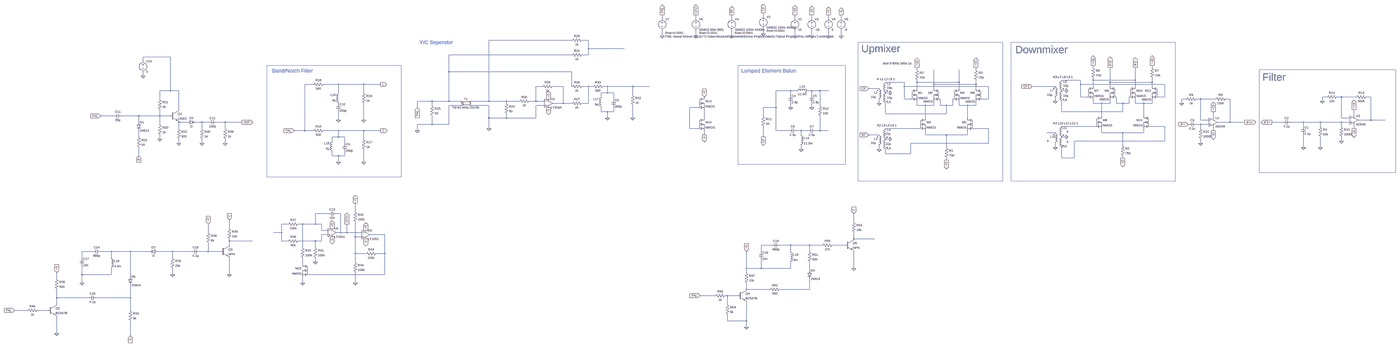
[diagram p0: schematic Gilbert_Cell_Mixer_Alt.asc, whole sheet]
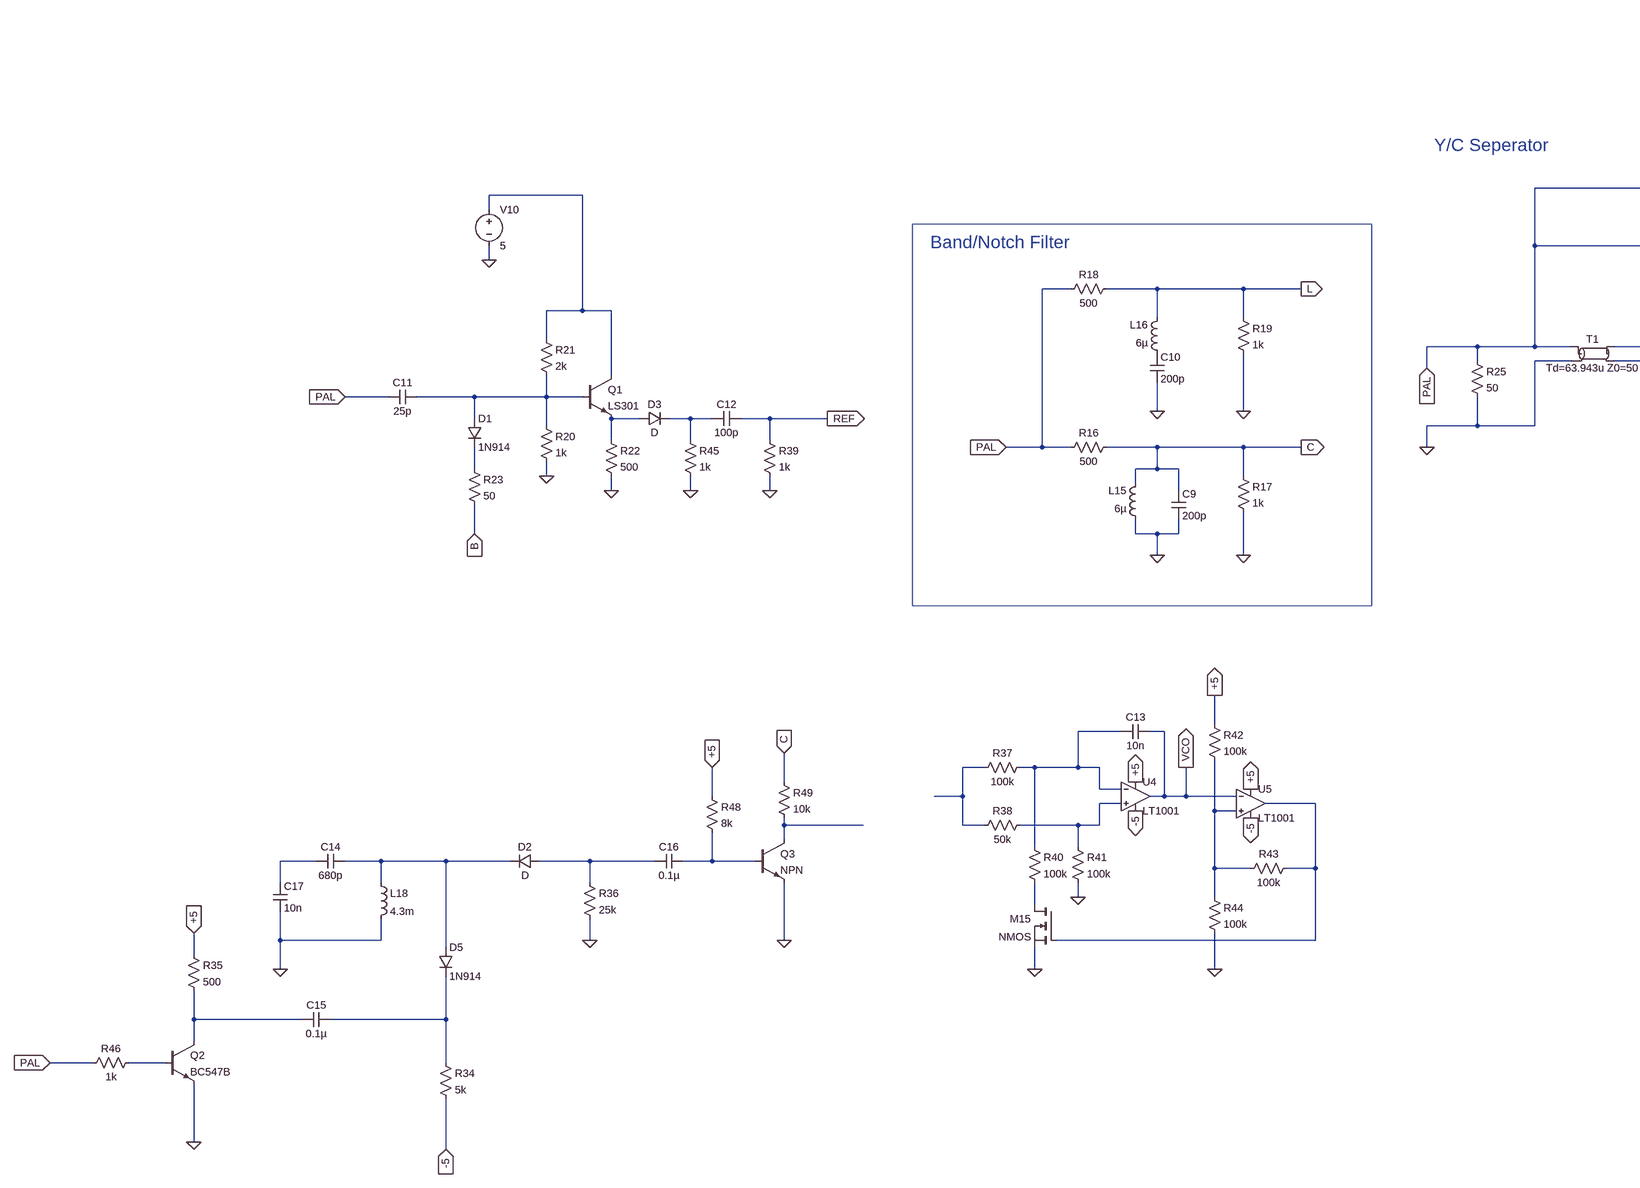
[diagram p1: schematic Gilbert_Cell_Mixer_Alt.asc, part, row 1 of 1, column 1 of 3]
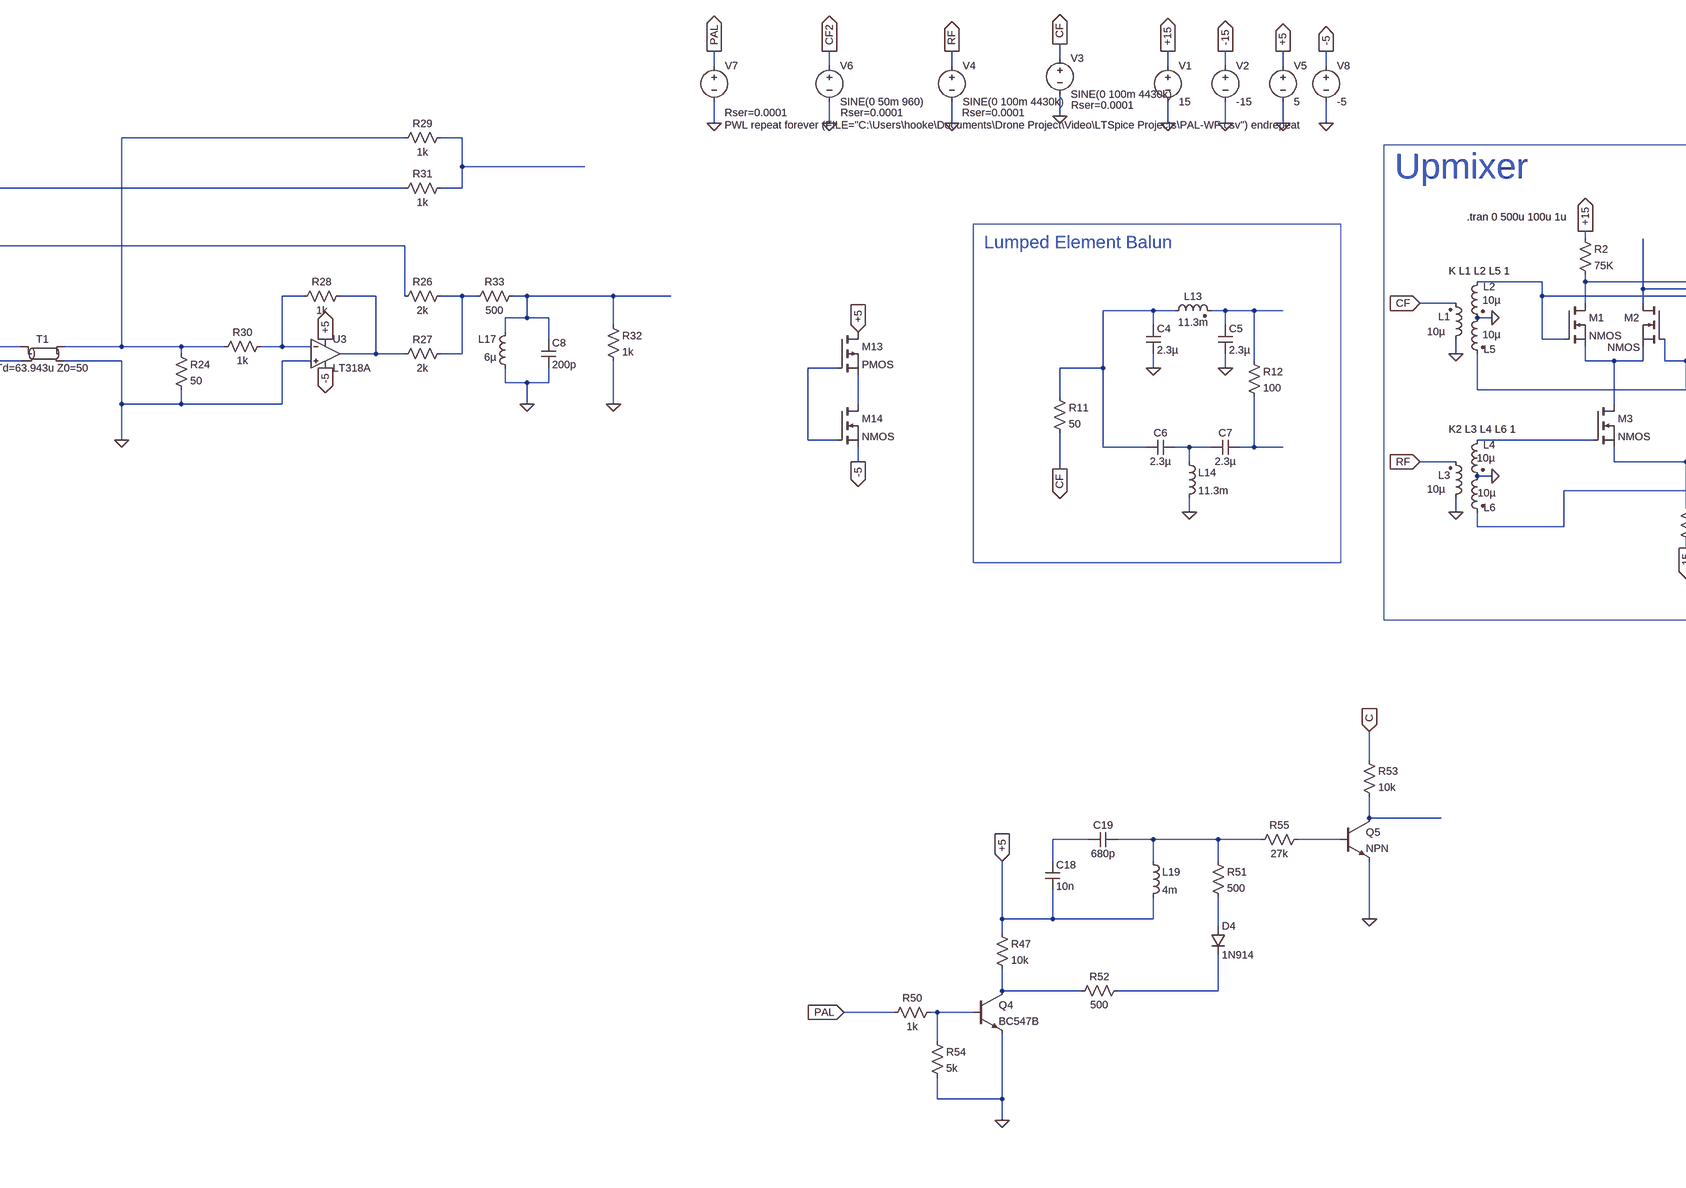
[diagram p2: schematic Gilbert_Cell_Mixer_Alt.asc, part, row 1 of 1, column 2 of 3]
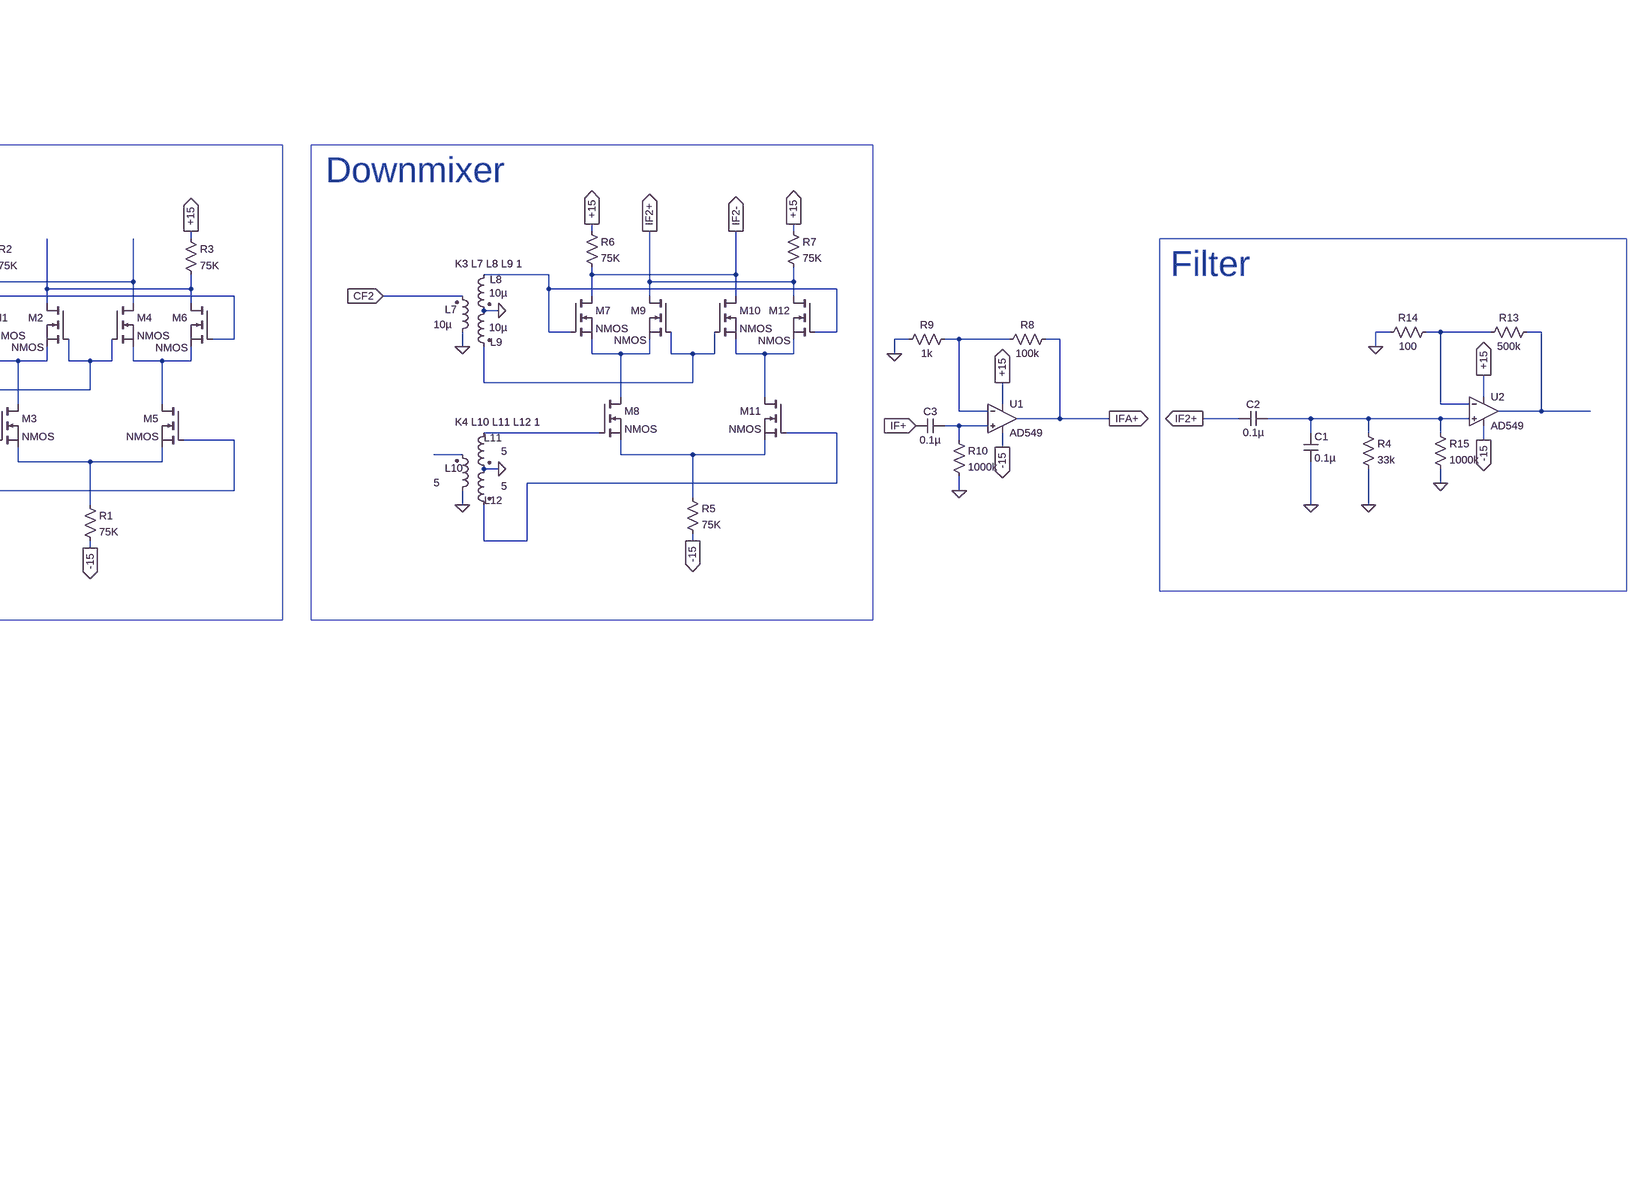
[diagram p3: schematic Gilbert_Cell_Mixer_Alt.asc, part, row 1 of 1, column 3 of 3]
Gilbert_Cell_Mixer_Alt.asc, the LTspice schematic file:
Version 4
SHEET 1 4096 2260
WIRE -1120 -464 -1120 -496
WIRE -1888 -448 -1888 -480
WIRE -1632 -448 -1632 -480
WIRE -1360 -448 -1360 -480
WIRE -880 -448 -880 -480
WIRE -752 -448 -752 -480
WIRE -624 -448 -624 -480
WIRE -528 -448 -528 -480
WIRE -1120 -336 -1120 -384
WIRE -1888 -320 -1888 -368
WIRE -1632 -320 -1632 -368
WIRE -1360 -320 -1360 -368
WIRE -880 -320 -880 -368
WIRE -752 -320 -752 -368
WIRE -624 -320 -624 -368
WIRE -528 -320 -528 -368
WIRE -2576 -288 -3248 -288
WIRE -2448 -288 -2496 -288
WIRE -2448 -224 -2448 -288
WIRE -2176 -224 -2448 -224
WIRE -2576 -176 -3552 -176
WIRE -2448 -176 -2448 -224
WIRE -2448 -176 -2496 -176
WIRE -6432 -160 -6640 -160
WIRE -6640 -128 -6640 -160
WIRE 1392 -80 1392 -96
WIRE 1840 -80 1840 -96
WIRE 48 -64 48 -80
WIRE 496 -64 496 -80
WIRE -3552 -48 -3552 -176
WIRE -2576 -48 -3552 -48
WIRE -6640 -16 -6640 -48
WIRE 1296 16 1152 16
WIRE 1392 16 1392 0
WIRE 1712 16 1712 -80
WIRE 1712 16 1392 16
WIRE -48 32 -192 32
WIRE 48 32 48 16
WIRE 368 32 368 -64
WIRE 368 32 48 32
WIRE 1520 32 1520 -80
WIRE 1840 32 1840 0
WIRE 1840 32 1520 32
WIRE -4992 48 -5056 48
WIRE -4800 48 -4912 48
WIRE -4608 48 -4800 48
WIRE -4480 48 -4608 48
WIRE 176 48 176 -64
WIRE 496 48 496 16
WIRE 496 48 176 48
WIRE 1296 48 1296 16
WIRE 1936 48 1296 48
WIRE -2800 64 -2848 64
WIRE -2640 64 -2720 64
WIRE -2576 64 -2576 -48
WIRE -2448 64 -2496 64
WIRE -2416 64 -2448 64
WIRE -2304 64 -2336 64
WIRE -2112 64 -2304 64
WIRE -1984 64 -2112 64
WIRE -48 64 -48 32
WIRE 592 64 -48 64
WIRE 1104 64 928 64
WIRE 1392 64 1392 16
WIRE 1520 64 1520 32
WIRE 1712 64 1712 16
WIRE 1840 64 1840 32
WIRE -240 80 -320 80
WIRE 48 80 48 32
WIRE 176 80 176 48
WIRE 368 80 368 32
WIRE 496 80 496 48
WIRE -6432 96 -6432 -160
WIRE -6432 96 -6512 96
WIRE -6368 96 -6432 96
WIRE -912 96 -1024 96
WIRE -864 96 -912 96
WIRE -752 96 -784 96
WIRE -688 96 -752 96
WIRE -624 96 -688 96
WIRE 1184 96 1152 96
WIRE -4800 112 -4800 48
WIRE -4608 112 -4608 48
WIRE -2304 112 -2304 64
WIRE -2304 112 -2352 112
WIRE -2256 112 -2304 112
WIRE -160 112 -192 112
WIRE -2112 128 -2112 64
WIRE -912 128 -912 96
WIRE -752 128 -752 96
WIRE -2352 144 -2352 112
WIRE 1296 144 1296 48
WIRE 1344 144 1296 144
WIRE 1936 144 1936 48
WIRE 1936 144 1888 144
WIRE 3184 144 3152 144
WIRE 3296 144 3264 144
WIRE 3408 144 3296 144
WIRE 3520 144 3488 144
WIRE -6512 160 -6512 96
WIRE -2256 160 -2256 112
WIRE -48 160 -48 64
WIRE 0 160 -48 160
WIRE 592 160 592 64
WIRE 592 160 544 160
WIRE 2096 160 2064 160
WIRE 2208 160 2176 160
WIRE 2320 160 2208 160
WIRE 2432 160 2400 160
WIRE -3680 176 -3792 176
WIRE -3552 176 -3552 -48
WIRE -3552 176 -3680 176
WIRE -3472 176 -3552 176
WIRE -3248 176 -3248 -288
WIRE -3248 176 -3376 176
WIRE -3072 176 -3248 176
WIRE -2976 176 -3072 176
WIRE -2848 176 -2848 64
WIRE -2848 176 -2896 176
WIRE -2784 176 -2848 176
WIRE 1104 176 1104 144
WIRE 3152 176 3152 144
WIRE -3072 192 -3072 176
WIRE -2640 192 -2640 64
WIRE -2640 192 -2720 192
WIRE -2576 192 -2640 192
WIRE -2448 192 -2448 64
WIRE -2448 192 -2496 192
WIRE -240 192 -240 160
WIRE 1392 192 1392 160
WIRE 1456 192 1392 192
WIRE 1520 192 1520 160
WIRE 1520 192 1456 192
WIRE 1568 192 1568 144
WIRE 1616 192 1568 192
WIRE 1664 192 1664 144
WIRE 1664 192 1616 192
WIRE 1712 192 1712 160
WIRE 1776 192 1712 192
WIRE 1840 192 1840 160
WIRE 1840 192 1776 192
WIRE 2064 192 2064 160
WIRE -3680 208 -3680 176
WIRE -3472 208 -3552 208
WIRE -3248 208 -3376 208
WIRE -2784 208 -2848 208
WIRE -688 208 -688 96
WIRE 48 208 48 176
WIRE 112 208 48 208
WIRE 176 208 176 176
WIRE 176 208 112 208
WIRE 224 208 224 160
WIRE 272 208 224 208
WIRE 320 208 320 160
WIRE 320 208 272 208
WIRE 368 208 368 176
WIRE 432 208 368 208
WIRE 496 208 496 176
WIRE 496 208 432 208
WIRE -3792 224 -3792 176
WIRE -1616 224 -1680 224
WIRE -1024 224 -1024 96
WIRE -1024 224 -1120 224
WIRE -912 224 -912 192
WIRE -752 224 -752 192
WIRE -6368 240 -6368 96
WIRE -2352 256 -2352 224
WIRE -2304 256 -2352 256
WIRE -2256 256 -2256 224
WIRE -2256 256 -2304 256
WIRE 1152 256 1152 176
WIRE 1616 256 1616 192
WIRE 1616 256 1152 256
WIRE -192 272 -192 192
WIRE 272 272 272 208
WIRE 272 272 -192 272
WIRE -6864 288 -6960 288
WIRE -6672 288 -6800 288
WIRE -6512 288 -6512 240
WIRE -6512 288 -6672 288
WIRE -6432 288 -6512 288
WIRE -1120 288 -1120 224
WIRE 1456 288 1456 192
WIRE 1776 288 1776 192
WIRE 3392 288 3392 240
WIRE -3248 304 -3248 208
WIRE -3072 304 -3072 272
WIRE -3072 304 -3248 304
WIRE -2848 304 -2848 208
WIRE -2848 304 -3072 304
WIRE -2304 304 -2304 256
WIRE -2112 304 -2112 208
WIRE -1568 304 -1568 240
WIRE 112 304 112 208
WIRE 432 304 432 208
WIRE 2304 304 2304 256
WIRE 3296 304 3296 144
WIRE 3360 304 3296 304
WIRE -4800 320 -4800 256
WIRE -4608 320 -4608 192
WIRE 2208 320 2208 160
WIRE 2272 320 2208 320
WIRE 3520 320 3520 144
WIRE 3520 320 3424 320
WIRE 3648 320 3520 320
WIRE -6672 336 -6672 288
WIRE -6304 336 -6368 336
WIRE -6192 336 -6240 336
WIRE -6144 336 -6192 336
WIRE -6016 336 -6080 336
WIRE -5888 336 -6016 336
WIRE 2432 336 2432 160
WIRE 2432 336 2336 336
WIRE 2560 336 2432 336
WIRE 2848 336 2768 336
WIRE 3008 336 2912 336
WIRE 3136 336 3008 336
WIRE 3296 336 3136 336
WIRE 3360 336 3296 336
WIRE -6512 352 -6512 288
WIRE -3680 352 -3680 288
WIRE -3680 352 -3792 352
WIRE -3552 352 -3552 208
WIRE -3552 352 -3680 352
WIRE 2208 352 2176 352
WIRE 2272 352 2208 352
WIRE 1408 368 1152 368
WIRE 1936 368 1824 368
WIRE 3008 368 3008 336
WIRE 3136 368 3136 336
WIRE 3296 368 3296 336
WIRE -6368 384 -6368 336
WIRE -6192 384 -6192 336
WIRE -6016 384 -6016 336
WIRE -3248 384 -3248 304
WIRE -1680 384 -1680 224
WIRE -1616 384 -1680 384
WIRE 64 384 -192 384
WIRE 592 384 480 384
WIRE 2208 384 2208 352
WIRE 3392 384 3392 352
WIRE -5056 400 -5056 48
WIRE -5056 400 -5136 400
WIRE -4992 400 -5056 400
WIRE -4800 400 -4912 400
WIRE -4608 400 -4800 400
WIRE -4480 400 -4608 400
WIRE -3792 400 -3792 352
WIRE -1024 400 -1024 224
WIRE -928 400 -1024 400
WIRE -832 400 -864 400
WIRE -784 400 -832 400
WIRE -688 400 -688 288
WIRE -688 400 -720 400
WIRE -624 400 -688 400
WIRE 2304 400 2304 368
WIRE 1104 416 1040 416
WIRE 1456 416 1456 384
WIRE 1616 416 1456 416
WIRE 1776 416 1776 384
WIRE 1776 416 1616 416
WIRE -1568 432 -1568 400
WIRE -832 432 -832 400
WIRE -240 432 -320 432
WIRE 112 432 112 400
WIRE 272 432 112 432
WIRE 432 432 432 400
WIRE 432 432 272 432
WIRE -6672 448 -6672 400
WIRE -4800 448 -4800 400
WIRE -4800 448 -4848 448
WIRE -4752 448 -4800 448
WIRE -1120 448 -1120 368
WIRE 1184 448 1152 448
WIRE -6512 464 -6512 432
WIRE -4608 464 -4608 400
WIRE -160 464 -192 464
WIRE -4848 480 -4848 448
WIRE 1936 480 1936 368
WIRE 1936 480 1248 480
WIRE 3296 480 3296 448
WIRE -6368 496 -6368 464
WIRE -6192 496 -6192 464
WIRE -6016 496 -6016 464
WIRE -4752 496 -4752 448
WIRE 592 496 592 384
WIRE 592 496 0 496
WIRE 2208 496 2208 464
WIRE 1616 512 1616 416
WIRE 272 528 272 432
WIRE 1104 528 1104 496
WIRE 3008 528 3008 432
WIRE 3136 528 3136 448
WIRE -832 544 -832 512
WIRE -240 544 -240 512
WIRE -192 576 -192 544
WIRE 0 576 0 496
WIRE 0 576 -192 576
WIRE -6672 592 -6672 528
WIRE -4848 592 -4848 560
WIRE -4800 592 -4848 592
WIRE -4752 592 -4752 560
WIRE -4752 592 -4800 592
WIRE 1152 608 1152 528
WIRE 1248 608 1248 480
WIRE 1248 608 1152 608
WIRE 1616 608 1616 592
WIRE 272 624 272 608
WIRE -4800 640 -4800 592
WIRE -4608 640 -4608 544
WIRE -4672 1104 -4672 1040
WIRE -4880 1120 -4976 1120
WIRE -4784 1120 -4816 1120
WIRE -432 1184 -432 1120
WIRE -5184 1200 -5232 1200
WIRE -5072 1200 -5104 1200
WIRE -4976 1200 -4976 1120
WIRE -4976 1200 -5072 1200
WIRE -4928 1200 -4976 1200
WIRE -5984 1232 -5984 1168
WIRE -4928 1248 -4928 1200
WIRE -4880 1248 -4928 1248
WIRE -6144 1264 -6144 1200
WIRE -5232 1264 -5232 1200
WIRE -5232 1264 -5296 1264
WIRE -4784 1264 -4784 1120
WIRE -4784 1264 -4816 1264
WIRE -4736 1264 -4736 1200
WIRE -4736 1264 -4784 1264
WIRE -4624 1264 -4736 1264
WIRE -4880 1280 -4928 1280
WIRE -4448 1280 -4560 1280
WIRE -4672 1296 -4672 1184
WIRE -4624 1296 -4672 1296
WIRE -432 1312 -432 1264
WIRE -272 1312 -432 1312
WIRE -5984 1328 -5984 1312
WIRE -5808 1328 -5984 1328
WIRE -5232 1328 -5232 1264
WIRE -5184 1328 -5232 1328
WIRE -4976 1328 -5104 1328
WIRE -4928 1328 -4928 1280
WIRE -4928 1328 -4976 1328
WIRE -5984 1360 -5984 1328
WIRE -1056 1360 -1136 1360
WIRE -912 1360 -992 1360
WIRE -768 1360 -912 1360
WIRE -672 1360 -768 1360
WIRE -496 1360 -592 1360
WIRE -5072 1376 -5072 1200
WIRE -4976 1376 -4976 1328
WIRE -7024 1408 -7104 1408
WIRE -6880 1408 -6960 1408
WIRE -6736 1408 -6880 1408
WIRE -6592 1408 -6736 1408
WIRE -6416 1408 -6528 1408
WIRE -6272 1408 -6416 1408
WIRE -6144 1408 -6144 1344
WIRE -6144 1408 -6208 1408
WIRE -6048 1408 -6144 1408
WIRE -1136 1408 -1136 1360
WIRE -912 1408 -912 1360
WIRE -768 1408 -768 1360
WIRE -4672 1424 -4672 1296
WIRE -4592 1424 -4672 1424
WIRE -4448 1424 -4448 1280
WIRE -4448 1424 -4512 1424
WIRE -7104 1456 -7104 1408
WIRE -6880 1456 -6880 1408
WIRE -6416 1456 -6416 1408
WIRE -4976 1488 -4976 1456
WIRE -4672 1488 -4672 1424
WIRE -5072 1504 -5072 1456
WIRE -1248 1536 -1248 1408
WIRE -1136 1536 -1136 1472
WIRE -1136 1536 -1248 1536
WIRE -912 1536 -912 1488
WIRE -912 1536 -1136 1536
WIRE -432 1536 -432 1408
WIRE -768 1552 -768 1488
WIRE -1248 1568 -1248 1536
WIRE -7104 1584 -7104 1520
WIRE -6880 1584 -6880 1536
WIRE -6880 1584 -7104 1584
WIRE -6416 1584 -6416 1536
WIRE -5984 1584 -5984 1456
WIRE -4448 1584 -4448 1424
WIRE -4448 1584 -5024 1584
WIRE -6736 1600 -6736 1408
WIRE -7296 1616 -7296 1568
WIRE -7104 1648 -7104 1584
WIRE -5072 1648 -5072 1600
WIRE -4672 1648 -4672 1568
WIRE -1248 1696 -1248 1648
WIRE -1072 1696 -1248 1696
WIRE -768 1696 -768 1616
WIRE -768 1696 -992 1696
WIRE -1488 1744 -1600 1744
WIRE -1392 1744 -1408 1744
WIRE -1312 1744 -1392 1744
WIRE -7296 1760 -7296 1696
WIRE -7056 1760 -7296 1760
WIRE -6736 1760 -6736 1664
WIRE -6736 1760 -6992 1760
WIRE -7296 1808 -7296 1760
WIRE -1392 1808 -1392 1744
WIRE -7520 1856 -7616 1856
WIRE -7360 1856 -7440 1856
WIRE -6736 1856 -6736 1760
WIRE -1392 1936 -1392 1888
WIRE -1248 1936 -1248 1792
WIRE -1248 1936 -1392 1936
WIRE -1248 1984 -1248 1936
WIRE -7296 2032 -7296 1904
WIRE -6736 2048 -6736 1936
FLAG -880 -480 +15
IOPIN -880 -480 Out
FLAG -752 -480 -15
IOPIN -752 -480 Out
FLAG -880 -320 0
FLAG -752 -320 0
FLAG 272 624 -15
IOPIN 272 624 Out
FLAG 48 -80 +15
IOPIN 48 -80 Out
FLAG 496 -80 +15
IOPIN 496 -80 Out
FLAG -1120 -496 CF
IOPIN -1120 -496 Out
FLAG -1120 -336 0
FLAG -1360 -480 RF
IOPIN -1360 -480 Out
FLAG -1360 -320 0
FLAG -320 80 CF
IOPIN -320 80 In
FLAG -160 112 0
FLAG -240 192 0
FLAG -160 464 0
FLAG -240 544 0
FLAG -624 -480 +5
IOPIN -624 -480 Out
FLAG -624 -320 0
FLAG 3008 528 0
FLAG 3136 528 0
FLAG 1616 608 -15
IOPIN 1616 608 Out
FLAG 1392 -96 +15
IOPIN 1392 -96 Out
FLAG 1840 -96 +15
IOPIN 1840 -96 Out
FLAG 1520 -80 IF2+
IOPIN 1520 -80 Out
FLAG 1712 -80 IF2-
IOPIN 1712 -80 Out
FLAG 928 64 CF2
IOPIN 928 64 In
FLAG 1184 96 0
FLAG 1104 176 0
FLAG -1632 -480 CF2
IOPIN -1632 -480 Out
FLAG -1632 -320 0
FLAG 1184 448 0
FLAG 1104 528 0
FLAG 2304 256 +15
IOPIN 2304 256 Out
FLAG 2304 400 -15
IOPIN 2304 400 Out
FLAG 2064 192 0
FLAG 2112 352 IF+
IOPIN 2112 352 In
FLAG 2208 496 0
FLAG 2560 336 IFA+
IOPIN 2560 336 Out
FLAG -1120 448 CF
IOPIN -1120 448 Out
FLAG -912 224 0
FLAG -752 224 0
FLAG -832 544 0
FLAG 2768 336 IF2+
IOPIN 2768 336 Out
FLAG 3392 240 +15
IOPIN 3392 240 Out
FLAG 3392 384 -15
IOPIN 3392 384 Out
FLAG 3152 176 0
FLAG 3296 480 0
FLAG -1888 -480 PAL
IOPIN -1888 -480 Out
FLAG -1888 -320 0
FLAG -5136 400 PAL
IOPIN -5136 400 In
FLAG -4800 640 0
FLAG -4800 320 0
FLAG -4608 640 0
FLAG -4608 320 0
FLAG -4480 48 L
IOPIN -4480 48 Out
FLAG -3248 384 0
FLAG -3792 224 PAL
IOPIN -3792 224 In
FLAG -3792 400 0
FLAG -528 -480 -5
IOPIN -528 -480 Out
FLAG -528 -320 0
FLAG -1568 144 +5
IOPIN -1568 144 In
FLAG -1568 432 -5
IOPIN -1568 432 Out
FLAG -2752 224 -5
IOPIN -2752 224 Out
FLAG -2752 160 +5
IOPIN -2752 160 Out
FLAG -2304 304 0
FLAG -2112 304 0
FLAG -6640 -16 0
FLAG -4976 1488 0
FLAG -5072 1648 0
FLAG -4672 1648 0
FLAG -4592 1248 +5
IOPIN -4592 1248 Out
FLAG -4848 1232 +5
IOPIN -4848 1232 Out
FLAG -4672 1040 +5
IOPIN -4672 1040 Out
FLAG -4848 1296 -5
IOPIN -4848 1296 Out
FLAG -4592 1312 -5
IOPIN -4592 1312 Out
FLAG -4736 1200 VCO
IOPIN -4736 1200 Out
FLAG -5888 336 REF
IOPIN -5888 336 Out
FLAG -6960 288 PAL
IOPIN -6960 288 In
FLAG -6672 592 B
IOPIN -6672 592 In
FLAG -6016 496 0
FLAG -6368 496 0
FLAG -6512 464 0
FLAG -6192 496 0
FLAG -320 432 RF
IOPIN -320 432 In
FLAG -7616 1856 PAL
IOPIN -7616 1856 In
FLAG -7296 2032 0
FLAG -6736 2048 -5
IOPIN -6736 2048 In
FLAG -7296 1568 +5
IOPIN -7296 1568 In
FLAG -7104 1648 0
FLAG -6416 1584 0
FLAG -5984 1584 0
FLAG -4480 400 C
IOPIN -4480 400 Out
FLAG -5984 1168 C
IOPIN -5984 1168 In
FLAG -6144 1200 +5
IOPIN -6144 1200 In
FLAG -1600 1744 PAL
IOPIN -1600 1744 In
FLAG -1248 1408 +5
IOPIN -1248 1408 In
FLAG -1248 1984 0
FLAG -432 1536 0
FLAG -432 1120 C
IOPIN -432 1120 In
SYMBOL nmos 0 80 R0
SYMATTR InstName M1
SYMBOL nmos 64 304 R0
SYMATTR InstName M3
SYMBOL nmos 224 80 M0
WINDOW 3 55 98 Left 2
SYMATTR InstName M2
SYMBOL nmos 320 80 R0
SYMATTR InstName M4
SYMBOL nmos 480 304 M0
SYMATTR InstName M5
SYMBOL nmos 544 80 M0
WINDOW 3 55 99 Left 2
SYMATTR InstName M6
SYMBOL res 256 512 R0
SYMATTR InstName R1
SYMATTR Value 75K
SYMATTR SpiceLine tol=1 pwr=0.1
SYMBOL res 32 -80 R0
SYMATTR InstName R2
SYMATTR Value 75K
SYMATTR SpiceLine tol=1 pwr=0.1
SYMBOL res 480 -80 R0
SYMATTR InstName R3
SYMATTR Value 75K
SYMATTR SpiceLine tol=1 pwr=0.1
SYMBOL voltage -880 -464 R0
WINDOW 123 0 0 Left 0
WINDOW 39 0 0 Left 0
SYMATTR InstName V1
SYMATTR Value 15
SYMBOL voltage -752 -464 R0
WINDOW 123 0 0 Left 0
WINDOW 39 0 0 Left 0
SYMATTR InstName V2
SYMATTR Value -15
SYMBOL ind2 -256 176 M180
WINDOW 0 -23 66 Left 2
WINDOW 3 -48 33 Left 2
SYMATTR InstName L1
SYMATTR Value 10µ
SYMATTR Type ind
SYMBOL ind2 -176 16 M0
WINDOW 0 -24 27 Left 2
WINDOW 3 -36 57 Left 2
SYMATTR InstName L2
SYMATTR Value 10µ
SYMATTR Type ind
SYMBOL voltage -1120 -480 R0
WINDOW 123 0 0 Left 0
WINDOW 39 25 120 Left 2
SYMATTR SpiceLine Rser=0.0001
SYMATTR InstName V3
SYMATTR Value SINE(0 100m 4430k)
SYMBOL voltage -1360 -464 R0
WINDOW 123 0 0 Left 0
WINDOW 39 23 120 Left 2
SYMATTR SpiceLine Rser=0.0001
SYMATTR InstName V4
SYMATTR Value SINE(0 100m 4430k)
SYMBOL ind2 -176 96 M0
WINDOW 0 -25 86 Left 2
WINDOW 3 -36 54 Left 2
SYMATTR InstName L5
SYMATTR Value 10µ
SYMATTR Type ind
SYMBOL ind2 -256 528 M180
WINDOW 0 -23 66 Left 2
WINDOW 3 -48 35 Left 2
SYMATTR InstName L3
SYMATTR Value 10µ
SYMATTR Type ind
SYMBOL ind2 -176 368 M0
WINDOW 0 -24 27 Left 2
WINDOW 3 -23 56 Left 2
SYMATTR InstName L4
SYMATTR Value 10µ
SYMATTR Type ind
SYMBOL ind2 -176 448 M0
WINDOW 0 -25 86 Left 2
WINDOW 3 -25 53 Left 2
SYMATTR InstName L6
SYMATTR Value 10µ
SYMATTR Type ind
SYMBOL cap 2992 368 R0
SYMATTR InstName C1
SYMATTR Value 0.1µ
SYMBOL cap 2912 320 R90
WINDOW 0 0 32 VBottom 2
WINDOW 3 32 32 VTop 2
SYMATTR InstName C2
SYMATTR Value 0.1µ
SYMBOL voltage -624 -464 R0
WINDOW 123 0 0 Left 0
WINDOW 39 0 0 Left 0
SYMATTR InstName V5
SYMATTR Value 5
SYMBOL res 3120 352 R0
SYMATTR InstName R4
SYMATTR Value 33k
SYMBOL nmos 1344 64 R0
SYMATTR InstName M7
SYMBOL nmos 1408 288 R0
SYMATTR InstName M8
SYMBOL nmos 1568 64 M0
WINDOW 3 55 98 Left 2
SYMATTR InstName M9
SYMBOL nmos 1664 64 R0
SYMATTR InstName M10
SYMBOL nmos 1824 288 M0
SYMATTR InstName M11
SYMBOL nmos 1888 64 M0
WINDOW 3 55 99 Left 2
SYMATTR InstName M12
SYMBOL res 1600 496 R0
SYMATTR InstName R5
SYMATTR Value 75K
SYMATTR SpiceLine tol=1 pwr=0.1
SYMBOL res 1376 -96 R0
SYMATTR InstName R6
SYMATTR Value 75K
SYMATTR SpiceLine tol=1 pwr=0.1
SYMBOL res 1824 -96 R0
SYMATTR InstName R7
SYMATTR Value 75K
SYMATTR SpiceLine tol=1 pwr=0.1
SYMBOL ind2 1088 160 M180
WINDOW 0 -23 66 Left 2
WINDOW 3 -48 33 Left 2
SYMATTR InstName L7
SYMATTR Value 10µ
SYMATTR Type ind
SYMBOL ind2 1168 0 M0
WINDOW 0 -24 27 Left 2
WINDOW 3 -36 57 Left 2
SYMATTR InstName L8
SYMATTR Value 10µ
SYMATTR Type ind
SYMBOL ind2 1168 80 M0
WINDOW 0 -25 86 Left 2
WINDOW 3 -36 54 Left 2
SYMATTR InstName L9
SYMATTR Value 10µ
SYMATTR Type ind
SYMBOL voltage -1632 -464 R0
WINDOW 123 0 0 Left 0
WINDOW 39 25 120 Left 2
SYMATTR SpiceLine Rser=0.0001
SYMATTR InstName V6
SYMATTR Value SINE(0 50m 960)
SYMBOL ind2 1088 512 M180
WINDOW 0 -23 66 Left 2
WINDOW 3 -48 33 Left 2
SYMATTR InstName L10
SYMATTR Value 5
SYMATTR Type ind
SYMBOL ind2 1168 352 M0
WINDOW 0 -24 27 Left 2
WINDOW 3 -36 57 Left 2
SYMATTR InstName L11
SYMATTR Value 5
SYMATTR Type ind
SYMBOL ind2 1168 432 M0
WINDOW 0 -25 86 Left 2
WINDOW 3 -36 54 Left 2
SYMATTR InstName L12
SYMATTR Value 5
SYMATTR Type ind
SYMBOL Opamps\\AD549 2304 272 R0
SYMATTR InstName U1
SYMBOL res 2416 144 R90
WINDOW 0 0 56 VBottom 2
WINDOW 3 32 56 VTop 2
SYMATTR InstName R8
SYMATTR Value 100k
SYMBOL res 2192 144 R90
WINDOW 0 0 56 VBottom 2
WINDOW 3 32 56 VTop 2
SYMATTR InstName R9
SYMATTR Value 1k
SYMBOL res 2192 368 R0
SYMATTR InstName R10
SYMATTR Value 1000k
SYMBOL cap 2176 336 R90
WINDOW 0 0 32 VBottom 2
WINDOW 3 32 32 VTop 2
SYMATTR InstName C3
SYMATTR Value 0.1µ
SYMBOL res -1136 272 R0
SYMATTR InstName R11
SYMATTR Value 50
SYMBOL cap -928 128 R0
SYMATTR InstName C4
SYMATTR Value 2.3µ
SYMBOL cap -768 128 R0
SYMATTR InstName C5
SYMATTR Value 2.3µ
SYMBOL cap -864 384 R90
WINDOW 0 0 32 VBottom 2
WINDOW 3 32 32 VTop 2
SYMATTR InstName C6
SYMATTR Value 2.3µ
SYMBOL cap -720 384 R90
WINDOW 0 0 32 VBottom 2
WINDOW 3 32 32 VTop 2
SYMATTR InstName C7
SYMATTR Value 2.3µ
SYMBOL ind2 -880 112 R270
WINDOW 0 32 56 VTop 2
WINDOW 3 5 56 VBottom 2
SYMATTR InstName L13
SYMATTR Value 11.3m
SYMATTR Type ind
SYMBOL ind -848 416 R0
SYMATTR InstName L14
SYMATTR Value 11.3m
SYMBOL res -704 192 R0
SYMATTR InstName R12
SYMATTR Value 100
SYMBOL Opamps\\AD549 3392 256 R0
SYMATTR InstName U2
SYMBOL res 3504 128 R90
WINDOW 0 0 56 VBottom 2
WINDOW 3 32 56 VTop 2
SYMATTR InstName R13
SYMATTR Value 500k
SYMBOL res 3280 128 R90
WINDOW 0 0 56 VBottom 2
WINDOW 3 32 56 VTop 2
SYMATTR InstName R14
SYMATTR Value 100
SYMBOL res 3280 352 R0
SYMATTR InstName R15
SYMATTR Value 1000k
SYMBOL voltage -1888 -464 R0
WINDOW 123 0 0 Left 0
WINDOW 39 23 120 Left 2
WINDOW 3 23 148 Left 2
SYMATTR SpiceLine Rser=0.0001
SYMATTR Value PWL repeat forever (FILE="C:\Users\hooke\Documents\Drone Project\Video\LTSpice Projects\PAL-WF.csv") endrepeat
SYMATTR InstName V7
SYMBOL ind -4832 576 R180
WINDOW 0 36 80 Left 2
WINDOW 3 36 40 Left 2
SYMATTR InstName L15
SYMATTR Value 6µ
SYMBOL cap -4768 496 R0
SYMATTR InstName C9
SYMATTR Value 200p
SYMBOL res -4896 384 R90
WINDOW 0 0 56 VBottom 2
WINDOW 3 32 56 VTop 2
SYMATTR InstName R16
SYMATTR Value 500
SYMBOL res -4624 448 R0
SYMATTR InstName R17
SYMATTR Value 1k
SYMBOL res -4896 32 R90
WINDOW 0 0 56 VBottom 2
WINDOW 3 32 56 VTop 2
SYMATTR InstName R18
SYMATTR Value 500
SYMBOL ind -4784 208 R180
WINDOW 0 36 80 Left 2
WINDOW 3 36 40 Left 2
SYMATTR InstName L16
SYMATTR Value 6µ
SYMBOL cap -4816 192 R0
SYMATTR InstName C10
SYMATTR Value 200p
SYMBOL res -4624 96 R0
SYMATTR InstName R19
SYMATTR Value 1k
SYMBOL res -6528 336 R0
SYMATTR InstName R20
SYMATTR Value 1k
SYMBOL res -6528 144 R0
SYMATTR InstName R21
SYMATTR Value 2k
SYMBOL npn -6432 240 R0
SYMATTR InstName Q1
SYMATTR Value LS301
SYMBOL res -6384 368 R0
SYMATTR InstName R22
SYMATTR Value 500
SYMBOL tline -3424 192 R0
SYMATTR InstName T1
SYMATTR Value Td=63.943u Z0=50
SYMBOL voltage -528 -464 R0
WINDOW 123 0 0 Left 0
WINDOW 39 0 0 Left 0
SYMATTR InstName V8
SYMATTR Value -5
SYMBOL pmos -1616 144 R0
SYMATTR InstName M13
SYMBOL nmos -1616 304 R0
SYMATTR InstName M14
SYMBOL res -3088 176 R0
SYMATTR InstName R24
SYMATTR Value 50
SYMBOL res -3696 192 R0
SYMATTR InstName R25
SYMATTR Value 50
SYMBOL Opamps\\LT318A -2752 192 R0
SYMATTR InstName U3
SYMBOL res -2880 160 R90
WINDOW 0 0 56 VBottom 2
WINDOW 3 32 56 VTop 2
SYMATTR InstName R30
SYMATTR Value 1k
SYMBOL res -2704 48 R90
WINDOW 0 0 56 VBottom 2
WINDOW 3 32 56 VTop 2
SYMATTR InstName R28
SYMATTR Value 1k
SYMBOL res -2480 -304 R90
WINDOW 0 0 56 VBottom 2
WINDOW 3 32 56 VTop 2
SYMATTR InstName R29
SYMATTR Value 1k
SYMBOL res -2480 -192 R90
WINDOW 0 0 56 VBottom 2
WINDOW 3 32 56 VTop 2
SYMATTR InstName R31
SYMATTR Value 1k
SYMBOL res -2480 48 R90
WINDOW 0 0 56 VBottom 2
WINDOW 3 32 56 VTop 2
SYMATTR InstName R26
SYMATTR Value 2k
SYMBOL res -2480 176 R90
WINDOW 0 0 56 VBottom 2
WINDOW 3 32 56 VTop 2
SYMATTR InstName R27
SYMATTR Value 2k
SYMBOL ind -2336 240 R180
WINDOW 0 36 80 Left 2
WINDOW 3 36 40 Left 2
SYMATTR InstName L17
SYMATTR Value 6µ
SYMBOL cap -2272 160 R0
SYMATTR InstName C8
SYMATTR Value 200p
SYMBOL res -2128 112 R0
SYMATTR InstName R32
SYMATTR Value 1k
SYMBOL res -2320 48 R90
WINDOW 0 0 56 VBottom 2
WINDOW 3 32 56 VTop 2
SYMATTR InstName R33
SYMATTR Value 500
SYMBOL npn -7360 1808 R0
SYMATTR InstName Q2
SYMATTR Value BC547B
SYMBOL res -7312 1600 R0
SYMATTR InstName R35
SYMATTR Value 500
SYMBOL res -6032 368 R0
SYMATTR InstName R39
SYMATTR Value 1k
SYMBOL diode -6688 336 R0
SYMATTR InstName D1
SYMATTR Value 1N914
SYMBOL res -6688 432 R0
SYMATTR InstName R23
SYMATTR Value 50
SYMBOL cap -6080 320 R90
WINDOW 0 0 32 VBottom 2
WINDOW 3 32 32 VTop 2
SYMATTR InstName C12
SYMATTR Value 100p
SYMBOL voltage -6640 -144 R0
WINDOW 123 0 0 Left 0
WINDOW 39 0 0 Left 0
SYMATTR InstName V10
SYMATTR Value 5
SYMBOL Opamps\\LT1001 -4848 1200 R0
SYMATTR InstName U4
SYMBOL Opamps\\LT1001 -4592 1216 R0
SYMATTR InstName U5
SYMBOL res -5088 1184 R90
WINDOW 0 0 56 VBottom 2
WINDOW 3 32 56 VTop 2
SYMATTR InstName R37
SYMATTR Value 100k
SYMBOL res -5088 1312 R90
WINDOW 0 0 56 VBottom 2
WINDOW 3 32 56 VTop 2
SYMATTR InstName R38
SYMATTR Value 50k
SYMBOL res -5088 1360 R0
SYMATTR InstName R40
SYMATTR Value 100k
SYMBOL res -4992 1360 R0
SYMATTR InstName R41
SYMATTR Value 100k
SYMBOL nmos -5024 1504 M0
SYMATTR InstName M15
SYMBOL cap -4816 1104 R90
WINDOW 0 0 32 VBottom 2
WINDOW 3 32 32 VTop 2
SYMATTR InstName C13
SYMATTR Value 10n
SYMBOL res -4688 1088 R0
SYMATTR InstName R42
SYMATTR Value 100k
SYMBOL res -4496 1408 R90
WINDOW 0 0 56 VBottom 2
WINDOW 3 32 56 VTop 2
SYMATTR InstName R43
SYMATTR Value 100k
SYMBOL res -4688 1472 R0
SYMATTR InstName R44
SYMATTR Value 100k
SYMBOL cap -6800 272 R90
WINDOW 0 0 32 VBottom 2
WINDOW 3 32 32 VTop 2
SYMATTR InstName C11
SYMATTR Value 25p
SYMBOL diode -6304 352 R270
WINDOW 0 32 32 VTop 2
WINDOW 3 0 32 VBottom 2
SYMATTR InstName D3
SYMBOL res -6208 368 R0
SYMATTR InstName R45
SYMATTR Value 1k
SYMBOL cap -6960 1392 R90
WINDOW 0 0 32 VBottom 2
WINDOW 3 32 32 VTop 2
SYMATTR InstName C14
SYMATTR Value 680p
SYMBOL ind -6896 1440 R0
SYMATTR InstName L18
SYMATTR Value 4.3m
SYMBOL cap -7120 1456 R0
SYMATTR InstName C17
SYMATTR Value 10n
SYMBOL diode -6752 1600 R0
SYMATTR InstName D5
SYMATTR Value 1N914
SYMBOL res -6752 1840 R0
SYMATTR InstName R34
SYMATTR Value 5k
SYMBOL cap -6992 1744 R90
WINDOW 0 0 32 VBottom 2
WINDOW 3 32 32 VTop 2
SYMATTR InstName C15
SYMATTR Value 0.1µ
SYMBOL res -7424 1840 R90
WINDOW 0 0 56 VBottom 2
WINDOW 3 32 56 VTop 2
SYMATTR InstName R46
SYMATTR Value 1k
SYMBOL diode -6528 1392 R90
WINDOW 0 0 32 VBottom 2
WINDOW 3 32 32 VTop 2
SYMATTR InstName D2
SYMBOL res -6432 1440 R0
SYMATTR InstName R36
SYMATTR Value 25k
SYMBOL npn -6048 1360 R0
SYMATTR InstName Q3
SYMBOL res -6000 1216 R0
SYMATTR InstName R49
SYMATTR Value 10k
SYMBOL cap -6208 1392 R90
WINDOW 0 0 32 VBottom 2
WINDOW 3 32 32 VTop 2
SYMATTR InstName C16
SYMATTR Value 0.1µ
SYMBOL res -6160 1248 R0
SYMATTR InstName R48
SYMATTR Value 8k
SYMBOL npn -1312 1696 R0
SYMATTR InstName Q4
SYMATTR Value BC547B
SYMBOL res -1264 1552 R0
SYMATTR InstName R47
SYMATTR Value 10k
SYMBOL res -1392 1728 R90
WINDOW 0 0 56 VBottom 2
WINDOW 3 32 56 VTop 2
SYMATTR InstName R50
SYMATTR Value 1k
SYMBOL res -1408 1792 R0
SYMATTR InstName R54
SYMATTR Value 5k
SYMBOL cap -992 1344 R90
WINDOW 0 0 32 VBottom 2
WINDOW 3 32 32 VTop 2
SYMATTR InstName C19
SYMATTR Value 680p
SYMBOL ind -928 1392 R0
SYMATTR InstName L19
SYMATTR Value 4m
SYMATTR SpiceLine Ipk=0.13 Rser=24.42 Rpar=806138 Cpar=0 mfg="Bourns, Inc." pn="SRF0703-102M-series"
SYMBOL diode -784 1552 R0
SYMATTR InstName D4
SYMATTR Value 1N914
SYMBOL res -784 1392 R0
SYMATTR InstName R51
SYMATTR Value 500
SYMBOL res -976 1680 R90
WINDOW 0 0 56 VBottom 2
WINDOW 3 32 56 VTop 2
SYMATTR InstName R52
SYMATTR Value 500
SYMBOL cap -1152 1408 R0
SYMATTR InstName C18
SYMATTR Value 10n
SYMBOL npn -496 1312 R0
SYMATTR InstName Q5
SYMBOL res -448 1168 R0
SYMATTR InstName R53
SYMATTR Value 10k
SYMBOL res -576 1344 R90
WINDOW 0 0 56 VBottom 2
WINDOW 3 32 56 VTop 2
SYMATTR InstName R55
SYMATTR Value 27k
TEXT -256 8 Left 2 !K L1 L2 L5 1
TEXT -216 -112 Left 2 !.tran 0 500u 100u 1u
TEXT -256 360 Left 2 !K2 L3 L4 L6 1
TEXT 1088 -8 Left 2 !K3 L7 L8 L9 1
TEXT 1088 344 Left 2 !K4 L10 L11 L12 1
TEXT 800 -216 Left 6 ;Downmixer
TEXT -1288 -56 Left 4 ;Lumped Element Balun
TEXT 2696 -8 Left 6 ;Filter
TEXT -376 -224 Left 6 ;Upmixer
TEXT -5304 -56 Left 4 ;Band/Notch Filter
TEXT -3776 -272 Left 4 ;Y/C Seperator
RECTANGLE Normal 2016 784 768 -272
RECTANGLE Normal -496 656 -1312 -96
RECTANGLE Normal 3728 720 2672 -64
RECTANGLE Normal -400 784 704 -272
RECTANGLE Normal -4320 752 -5344 -96

The netlist it stands for:
* Gilbert_Cell_Mixer_Alt.asc
M1 N006 N005 N020 N020 NMOS
M3 N020 N032 N038 N038 NMOS
M2 N007 N021 N020 N020 NMOS
M4 N006 N021 N022 N022 NMOS
M5 N022 N033 N038 N038 NMOS
M6 N007 N005 N022 N022 NMOS
R1 N038 -15 75K tol=1 pwr=0.1
R2 +15 N006 75K tol=1 pwr=0.1
R3 +15 N007 75K tol=1 pwr=0.1
V1 +15 0 15
V2 -15 0 -15
L1 0 CF 10µ
L2 N005 0 10µ
V3 CF 0 SINE(0 100m 4430k) Rser=0.0001
V4 RF 0 SINE(0 100m 4430k) Rser=0.0001
L5 0 N021 10µ
L3 0 RF 10µ
L4 N032 0 10µ
L6 0 N033 10µ
C1 N028 0 0.1µ
C2 N028 IF2+ 0.1µ
V5 +5 0 5
R4 N028 0 33k
M7 IF2- N004 N017 N017 NMOS
M8 N017 N030 N037 N037 NMOS
M9 IF2+ N018 N017 N017 NMOS
M10 IF2- N018 N019 N019 NMOS
M11 N019 N031 N037 N037 NMOS
M12 IF2+ N004 N019 N019 NMOS
R5 N037 -15 75K tol=1 pwr=0.1
R6 +15 IF2- 75K tol=1 pwr=0.1
R7 +15 IF2+ 75K tol=1 pwr=0.1
L7 0 CF2 10µ
L8 N004 0 10µ
L9 0 N018 10µ
V6 CF2 0 SINE(0 50m 960) Rser=0.0001
L10 0 N036 5
L11 N030 0 5
L12 0 N031 5
XU1 N029 N016 +15 -15 IFA+ AD549  ; pins In+ In- V+ V- OUT
R8 IFA+ N016 100k
R9 N016 0 1k
R10 N029 0 1000k
C3 N029 IF+ 0.1µ
R11 N012 CF 50
C4 N012 0 2.3µ
C5 N013 0 2.3µ
C6 N034 N012 2.3µ
C7 N035 N034 2.3µ
L13 N012 N013 11.3m
L14 N034 0 11.3m
R12 N013 N035 100
XU2 N028 N014 +15 -15 N015 AD549  ; pins In+ In- V+ V- OUT
R13 N015 N014 500k
R14 N014 0 100
R15 N028 0 1000k
V7 PAL 0 PWL repeat forever (FILE="C:\Users\hooke\Documents\Drone Project\Video\LTSpice Projects\PAL-WF.csv") endrepeat Rser=0.0001
L15 0 C 6µ
C9 C 0 200p
R16 C PAL 500
R17 C 0 1k
R18 L PAL 500
L16 P001 L 6µ
C10 P001 0 200p
R19 L 0 1k
R20 N024 0 1k
R21 N003 N024 2k
Q1 N003 N024 N026 0 LS301
R22 N026 0 500
T1 PAL 0 N001 0 Td=63.943u Z0=50
V8 -5 0 -5
M13 +5 N023 N025 N025 PMOS
M14 N025 N023 -5 -5 NMOS
R24 N001 0 50
R25 PAL 0 50
* U3: LT318A (symbol Opamps\LT318A not available, pins judged from their places): In+=0 In-=N008 V+=+5 V-=-5 OUT=N009
R30 N008 N001 1k
R28 N009 N008 1k
R29 N002 N001 1k
R31 N002 PAL 1k
R26 N010 PAL 2k
R27 N010 N009 2k
L17 0 N011 6µ
C8 N011 0 200p
R32 N011 0 1k
R33 N011 N010 500
Q2 N059 N061 0 0 BC547B
R35 +5 N059 500
R39 REF 0 1k
D1 N024 N039 1N914
R23 N039 B 50
C12 REF N027 100p
V10 N003 0 5
XU4 N042 N040 +5 -5 VCO LT1001  ; pins In+ In- V+ V- OUT
XU5 N044 VCO +5 -5 N043 LT1001  ; pins In+ In- V+ V- OUT
R37 N040 N041 100k
R38 N042 N041 50k
R40 N040 N054 100k
R41 N042 0 100k
M15 N054 N043 0 0 NMOS
C13 VCO N040 10n
R42 +5 N044 100k
R43 N043 N044 100k
R44 N044 0 100k
C11 N024 PAL 25p
D3 N026 N027 D
R45 N027 0 1k
C14 N051 N050 680p
L18 N051 0 4.3m
C17 N050 0 10n
D5 N051 N060 1N914
R34 N060 -5 5k
C15 N060 N059 0.1µ
R46 N061 PAL 1k
D2 N052 N051 D
R36 N052 0 25k
Q3 N046 N053 0 0 NPN
R49 C N046 10k
C16 N053 N052 0.1µ
R48 +5 N053 8k
Q4 N056 N058 0 0 BC547B
R47 +5 N056 10k
R50 N058 PAL 1k
R54 N058 0 5k
C19 N048 N047 680p
L19 N048 +5 4m Ipk=0.13 Rser=24.42 Rpar=806138 Cpar=0 mfg="Bourns, Inc." pn="SRF0703-102M-series"
D4 N055 N057 1N914
R51 N048 N055 500
R52 N057 N056 500
C18 N047 +5 10n
Q5 N045 N049 0 0 NPN
R53 C N045 10k
R55 N049 N048 27k
.model D D
.lib standard.dio
.model NPN NPN
.model PNP PNP
.lib standard.bjt
.model NMOS NMOS
.model PMOS PMOS
.lib standard.mos
K L1 L2 L5 1
.tran 0 500u 100u 1u
K2 L3 L4 L6 1
K3 L7 L8 L9 1
K4 L10 L11 L12 1
* Downmixer
* Lumped Element Balun
* Filter
* Upmixer
* Band/Notch Filter
* Y/C Seperator
.lib LTC.lib
.backanno
.end